# Altium project Excavator.PrjPcb
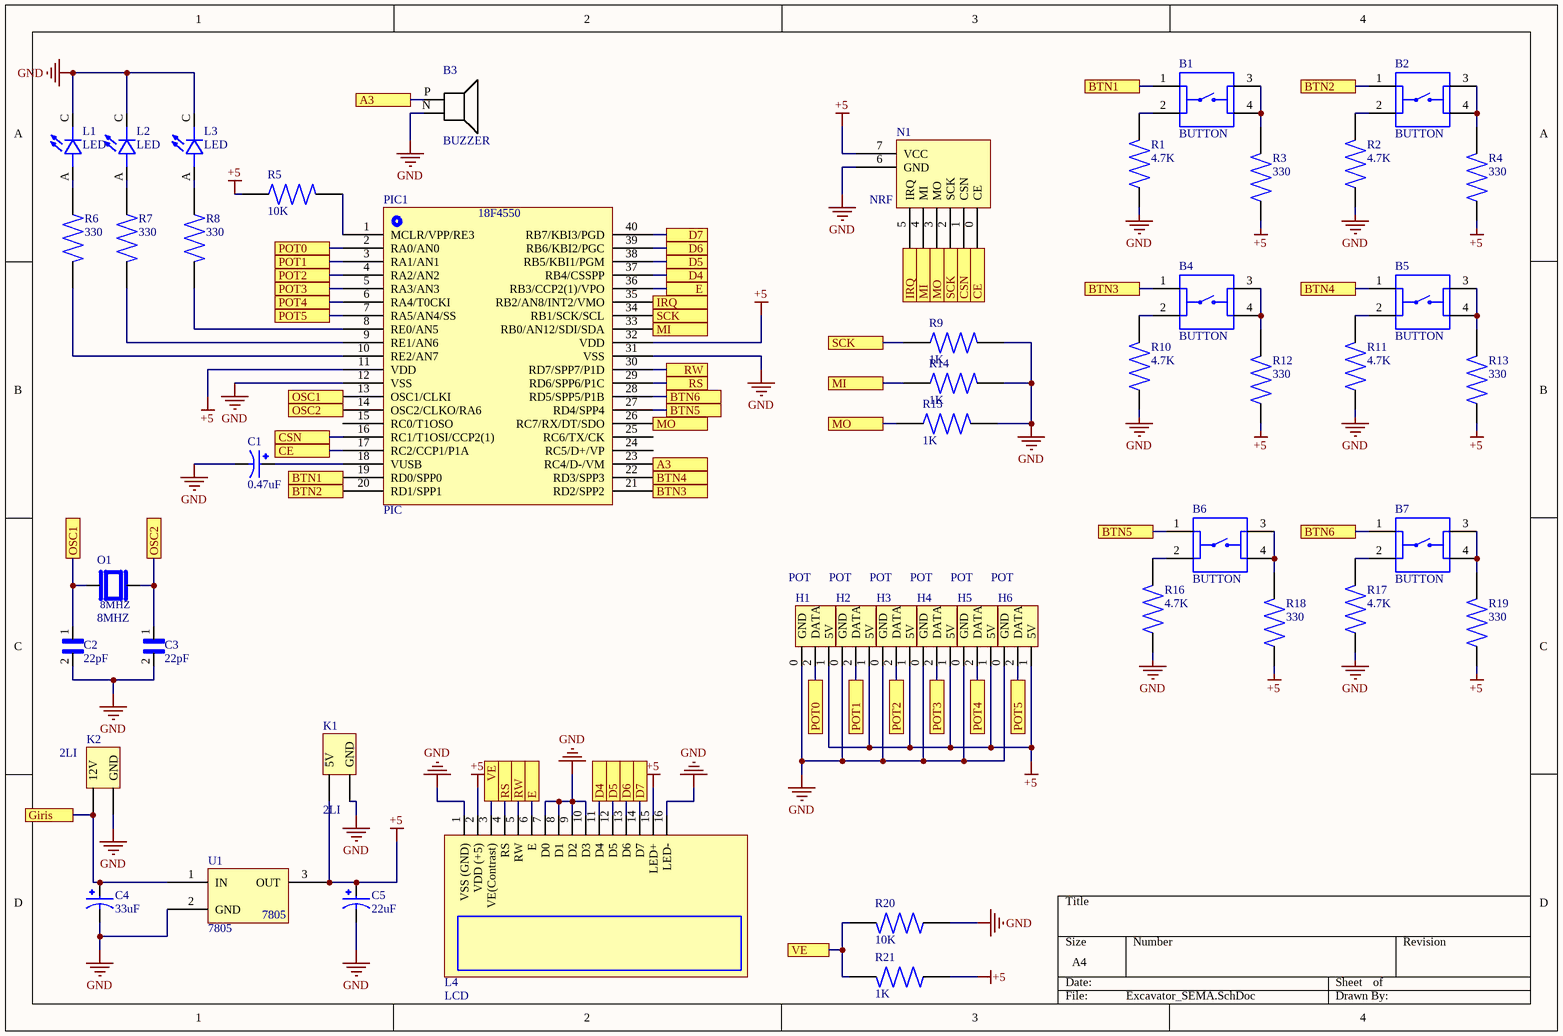
[diagram p0: Excavator_SEMA.SchDoc]
1 sheet, 49 parts. Net scope: flat (ports and power ports of the same name join across sheets).
Board file: Excavator_PCB.PcbDoc

## Sheet Excavator_SEMA.SchDoc
size A4; SheetNumber: 1; SheetTotal: 1

### Parts
B1  BUTTON  [BUTTON]
B2  BUTTON  [BUTTON]
B3  BUZZER  [buzzer]
B4  BUTTON  [BUTTON]
B5  BUTTON  [BUTTON]
B6  BUTTON  [BUTTON]
B7  BUTTON  [BUTTON]
C1  0.47uF  [CAP]
C2  22pF  [22pF]
C3  22pF  [22pF]
C4  33uF  [CAP]
C5  22uF  [CAP]
H1  POT  [HEADER1x3]
H2  POT  [HEADER1x3]
H3  POT  [HEADER1x3]
H4  POT  [HEADER1x3]
H5  POT  [HEADER1x3]
H6  POT  [HEADER1x3]
K1  2LI  [klemens2li]
K2  2LI  [klemens12V]
L1  LED  [LED_GREEN]
L2  LED  [LED_GREEN]
L3  LED  [LED_GREEN]
L4  LCD  [LCD_Header]
N1  NRF  [NRF24L01]
O1  8MHZ  [8MHZ]
PIC1  PIC  [PIC18F4550]
R1  4.7K  [1K_RES]
R2  4.7K  [1K_RES]
R3  330  [330_RES]
R4  330  [330_RES]
R5  10K  [10K_RES]
R6  330  [330_RES]
R7  330  [330_RES]
R8  330  [330_RES]
R9  1K  [1K_RES]
R10  4.7K  [1K_RES]
R11  4.7K  [1K_RES]
R12  330  [330_RES]
R13  330  [330_RES]
R14  1K  [1K_RES]
R15  1K  [1K_RES]
R16  4.7K  [1K_RES]
R17  4.7K  [1K_RES]
R18  330  [330_RES]
R19  330  [330_RES]
R20  10K  [10K_RES]
R21  1K  [1K_RES]
U1  7805  [7805]

### Ports
A3, BTN1, BTN2, BTN3, BTN4, BTN5, BTN6, CE, CSN, D4, D5, D6, D7, E, Giris, IRQ, MI, MO, OSC1, OSC2, POT0, POT1, POT2, POT3, POT4, POT5, RS, RW, SCK, VE

### Nets
+5: C5.P H1.1(5V) H2.1(5V) H3.1(5V) H4.1(5V) H5.1(5V) H6.1(5V) K1.P(5V) L4.2(VDD_(+5)) L4.15(LED+) N1.7(VCC) PIC1.11(VDD) PIC1.32(VDD) R3.1 R4.1 R5.1 R12.1 R13.1 R18.1 R19.1 R21.1 U1.3(OUT)
GND: B3.N C1.N C2.2 C3.2 C4.N C5.N H1.0(GND) H2.0(GND) H3.0(GND) H4.0(GND) H5.0(GND) H6.0(GND) K1.N(GND) K2.N(GND) L1.C L2.C L3.C L4.1(VSS_(GND)) L4.7(D0) L4.8(D1) L4.9(D2) L4.10(D3) L4.16(LED-) N1.6(GND) PIC1.12(VSS) PIC1.31(VSS) R1.1 R2.1 R9.2 R10.1 R11.1 R14.2 R15.2 R16.1 R17.1 R20.1 U1.2(GND)
NetB1_1: B1.1 PIC1.19(RD0/SPP0) ; port BTN1
NetB1_2: B1.2 R1.2
NetB1_3: B1.3 B1.4 R3.2
NetB2_1: B2.1 PIC1.20(RD1/SPP1) ; port BTN2
NetB2_2: B2.2 R2.2
NetB2_3: B2.3 B2.4 R4.2
NetB3_P: B3.P PIC1.23(RC4/D-/VM) ; port A3
NetB4_1: B4.1 PIC1.21(RD2/SPP2) ; port BTN3
NetB4_2: B4.2 R10.2
NetB4_3: B4.3 B4.4 R12.2
NetB5_1: B5.1 PIC1.22(RD3/SPP3) ; port BTN4
NetB5_2: B5.2 R11.2
NetB5_3: B5.3 B5.4 R13.2
NetB6_1: B6.1 PIC1.27(RD4/SPP4) ; port BTN5
NetB6_2: B6.2 R16.2
NetB6_3: B6.3 B6.4 R18.2
NetB7_1: B7.1 PIC1.28(RD5/SPP5/P1B) ; port BTN6
NetB7_2: B7.2 R17.2
NetB7_3: B7.3 B7.4 R19.2
NetC1_P: C1.P PIC1.18(VUSB)
NetC2_1: C2.1 O1.1 PIC1.13(OSC1/CLKI) ; port OSC1
NetC3_1: C3.1 O1.2 PIC1.14(OSC2/CLKO/RA6) ; port OSC2
NetC4_P: C4.P K2.P(12V) U1.1(IN) ; port Giris
NetH1_2: H1.2(DATA) PIC1.2(RA0/AN0) ; port POT0
NetH2_2: H2.2(DATA) PIC1.3(RA1/AN1) ; port POT1
NetH3_2: H3.2(DATA) PIC1.4(RA2/AN2) ; port POT2
NetH4_2: H4.2(DATA) PIC1.5(RA3/AN3) ; port POT3
NetH5_2: H5.2(DATA) PIC1.6(RA4/T0CKI) ; port POT4
NetH6_2: H6.2(DATA) PIC1.7(RA5/AN4/SS) ; port POT5
NetL1_A: L1.A R6.1
NetL2_A: L2.A R7.1
NetL3_A: L3.A R8.1
NetL4_3: L4.3(VE(Contrast)) R20.2 R21.2 ; port VE
NetL4_4: L4.4(RS) PIC1.29(RD6/SPP6/P1C) ; port RS
NetL4_5: L4.5(RW) PIC1.30(RD7/SPP7/P1D) ; port RW
NetL4_6: L4.6(E) PIC1.36(RB3/CCP2(1)/VPO) ; port E
NetL4_11: L4.11(D4) PIC1.37(RB4/CSSPP) ; port D4
NetL4_12: L4.12(D5) PIC1.38(RB5/KBI1/PGM) ; port D5
NetL4_13: L4.13(D6) PIC1.39(RB6/KBI2/PGC) ; port D6
NetL4_14: L4.14(D7) PIC1.40(RB7/KBI3/PGD) ; port D7
NetN1_0: N1.0(CE) PIC1.17(RC2/CCP1/P1A) ; port CE
NetN1_1: N1.1(CSN) PIC1.16(RC1/T1OSI/CCP2(1)) ; port CSN
NetN1_2: N1.2(SCK) PIC1.34(RB1/SCK/SCL) R9.1 ; port SCK
NetN1_3: N1.3(MO) PIC1.26(RC7/RX/DT/SDO) R15.1 ; port MO
NetN1_4: N1.4(MI) PIC1.33(RB0/AN12/SDI/SDA) R14.1 ; port MI
NetN1_5: N1.5(IRQ) PIC1.35(RB2/AN8/INT2/VMO) ; port IRQ
NetPIC1_1: PIC1.1(MCLR/VPP/RE3) R5.2
NetPIC1_8: PIC1.8(RE0/AN5) R8.2
NetPIC1_9: PIC1.9(RE1/AN6) R7.2
NetPIC1_10: PIC1.10(RE2/AN7) R6.2

Not connected (* = marked no-connect by the designer): PIC1 15(RC0/T1OSO) 24(RC5/D+/VP) 25(RC6/TX/CK)

### Notes on the sheet
- (in symbol PIC18f4550) 18F4550

### Library data of the parts
H1-H6 = POT_HEADER
K1 = KLEMENS2LI
K2 = KLEMENS12V
L1-L3 = LED_GREEN
L4 = LCD_HEADER
N1 = NRF24L01
PIC1 = PIC18f4550
R1 R2 R10 R11 R16 R17 = 4.7K_RES
R3 R4 R6-R8 R12 R13 R18 R19 = 330_RES
R5 R20 = 10K_RES
R9 R14 R15 R21 = 1K_RES